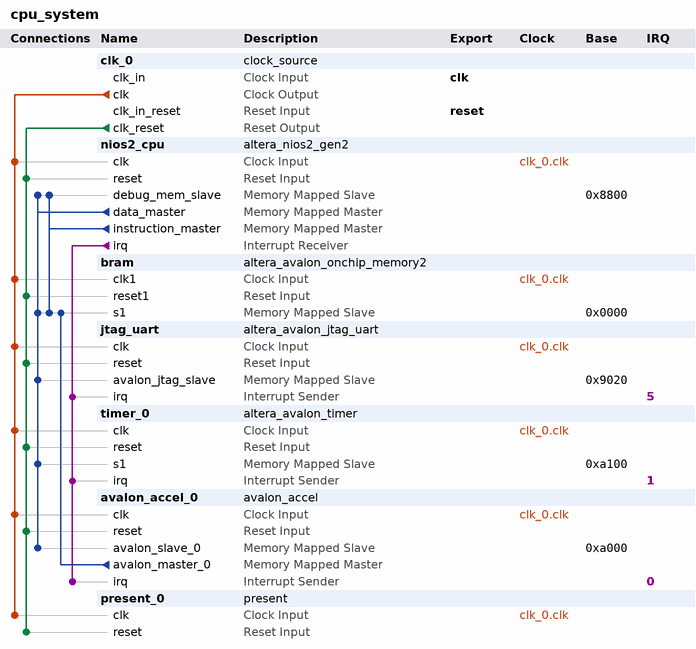
[diagram p0: system contents]
# Platform Designer (Qsys) system cpu_system, Cyclone V 5CSEMA5F31C6
# Parameters at their usual value, and those the tool derives, are not listed.
package require -exact qsys 21.1
create_system cpu_system
set_project_property DEVICE_FAMILY {Cyclone V}
set_project_property DEVICE 5CSEMA5F31C6

add_instance clk_0 clock_source 21.1
set_instance_parameter_value clk_0 clockFrequency 50000000

add_instance nios2_cpu altera_nios2_gen2 21.1
set_instance_parameter_value nios2_cpu dcache_size 2048
set_instance_parameter_value nios2_cpu exceptionSlave bram.s1
set_instance_parameter_value nios2_cpu icache_size 4096
set_instance_parameter_value nios2_cpu impl Tiny
set_instance_parameter_value nios2_cpu resetSlave bram.s1

add_instance bram altera_avalon_onchip_memory2 21.1
set_instance_parameter_value bram dataWidth 32
set_instance_parameter_value bram dualPort false
set_instance_parameter_value bram initMemContent true
set_instance_parameter_value bram initializationFileName onchip_mem.hex
set_instance_parameter_value bram memorySize 20480

add_instance jtag_uart altera_avalon_jtag_uart 21.1
set_instance_parameter_value jtag_uart simInteractiveOptions NO_INTERACTIVE_WINDOWS

add_instance timer_0 altera_avalon_timer 21.1
set_instance_parameter_value timer_0 period 100
set_instance_parameter_value timer_0 periodUnits MSEC

add_instance avalon_accel_0 avalon_accel 1.0

add_instance present_0 present 1.0

# connections
add_connection clk_0.clk avalon_accel_0.clk clock
add_connection clk_0.clk bram.clk1 clock
add_connection clk_0.clk jtag_uart.clk clock
add_connection clk_0.clk nios2_cpu.clk clock
add_connection clk_0.clk present_0.clk clock
add_connection clk_0.clk timer_0.clk clock
add_connection clk_0.clk_reset avalon_accel_0.reset reset
add_connection clk_0.clk_reset bram.reset1 reset
add_connection clk_0.clk_reset jtag_uart.reset reset
add_connection clk_0.clk_reset nios2_cpu.reset reset
add_connection clk_0.clk_reset present_0.reset reset
add_connection clk_0.clk_reset timer_0.reset reset
add_connection avalon_accel_0.avalon_master_0 bram.s1 avalon
set_connection_parameter_value avalon_accel_0.avalon_master_0/bram.s1 baseAddress 0x0000
add_connection nios2_cpu.data_master avalon_accel_0.avalon_slave_0 avalon
set_connection_parameter_value nios2_cpu.data_master/avalon_accel_0.avalon_slave_0 baseAddress 0xa000
add_connection nios2_cpu.data_master bram.s1 avalon
set_connection_parameter_value nios2_cpu.data_master/bram.s1 baseAddress 0x0000
add_connection nios2_cpu.data_master jtag_uart.avalon_jtag_slave avalon
set_connection_parameter_value nios2_cpu.data_master/jtag_uart.avalon_jtag_slave baseAddress 0x9020
add_connection nios2_cpu.data_master nios2_cpu.debug_mem_slave avalon
set_connection_parameter_value nios2_cpu.data_master/nios2_cpu.debug_mem_slave baseAddress 0x8800
add_connection nios2_cpu.data_master timer_0.s1 avalon
set_connection_parameter_value nios2_cpu.data_master/timer_0.s1 baseAddress 0xa100
add_connection nios2_cpu.instruction_master bram.s1 avalon
set_connection_parameter_value nios2_cpu.instruction_master/bram.s1 baseAddress 0x0000
add_connection nios2_cpu.instruction_master nios2_cpu.debug_mem_slave avalon
set_connection_parameter_value nios2_cpu.instruction_master/nios2_cpu.debug_mem_slave baseAddress 0x8800
add_connection nios2_cpu.irq avalon_accel_0.irq interrupt
set_connection_parameter_value nios2_cpu.irq/avalon_accel_0.irq irqNumber 0
add_connection nios2_cpu.irq jtag_uart.irq interrupt
set_connection_parameter_value nios2_cpu.irq/jtag_uart.irq irqNumber 5
add_connection nios2_cpu.irq timer_0.irq interrupt
set_connection_parameter_value nios2_cpu.irq/timer_0.irq irqNumber 1

# exported interfaces
add_interface clk clock sink
set_interface_property clk EXPORT_OF clk_0.clk_in
add_interface reset reset sink
set_interface_property reset EXPORT_OF clk_0.clk_in_reset

set_interconnect_requirement {$system} qsys_mm.clockCrossingAdapter HANDSHAKE
set_interconnect_requirement {$system} qsys_mm.enableEccProtection FALSE
set_interconnect_requirement {$system} qsys_mm.insertDefaultSlave FALSE
set_interconnect_requirement {$system} qsys_mm.maxAdditionalLatency 1

save_system cpu_system.qsys
